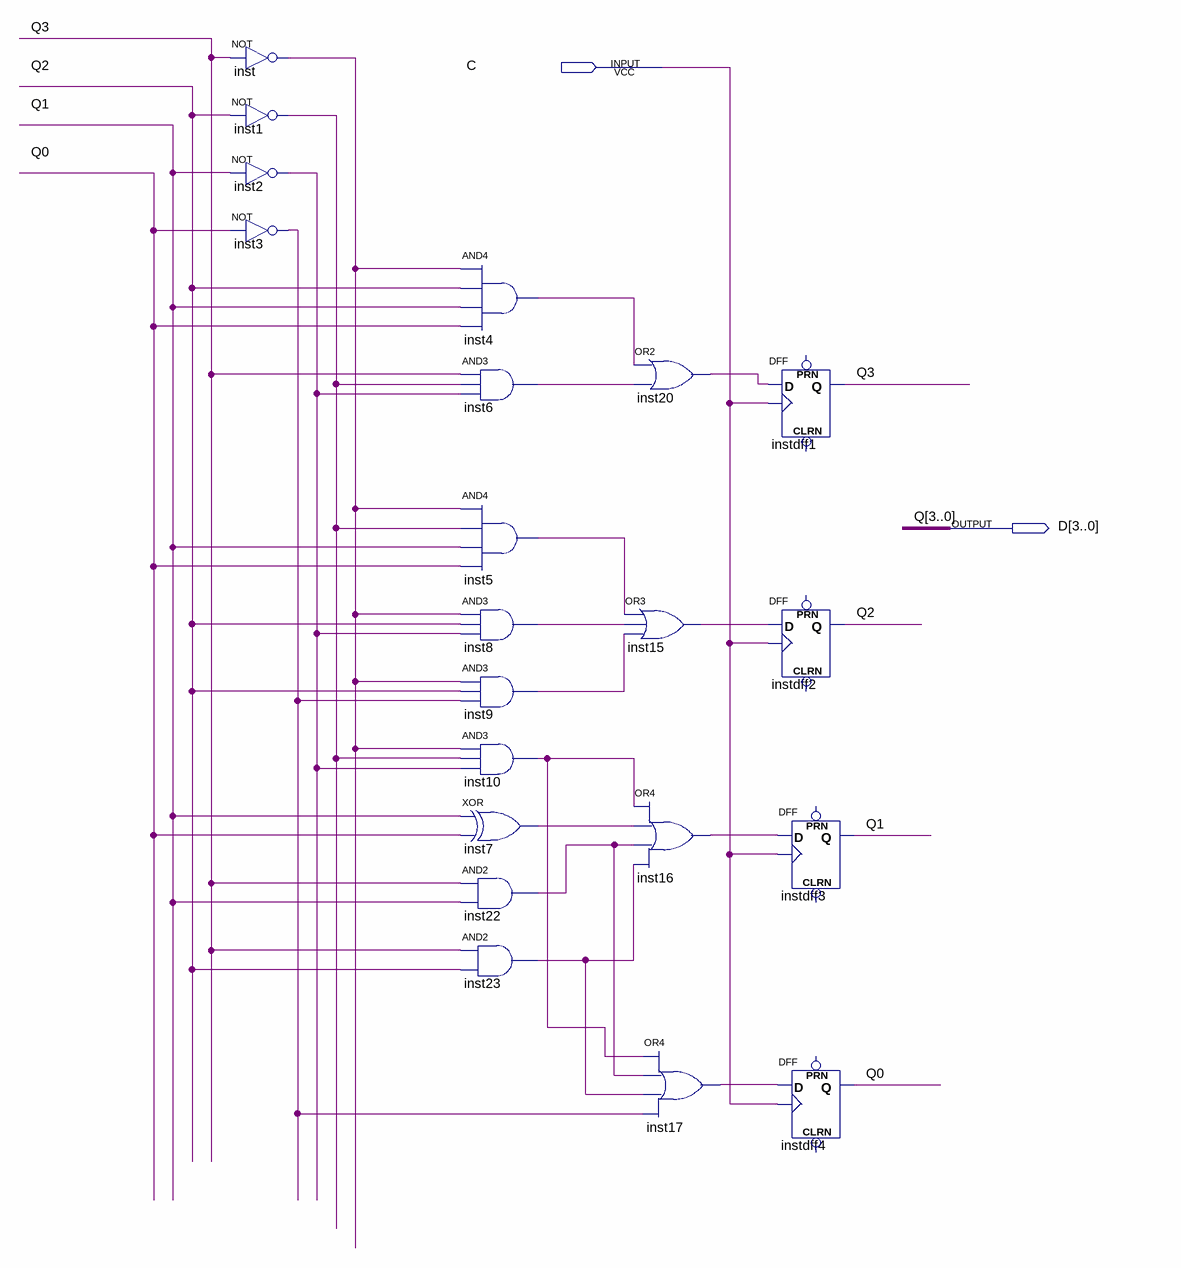
[diagram p0: schematic sheet]
// Quartus schematic 7_3.bdf as structural Verilog: 21 symbols, 2 pins
module \7_3  (
  input  C,
  output [3:0] D
);

  wire inst1_out, inst2_out, inst3_out, inst4_out, inst5_out, inst6_out, inst7_out, inst8_out, inst9_out,
       inst10_out, inst15_out, inst16_out, inst17_out, inst20_out, inst22_out, inst23_out, inst_out;

  not inst (inst_out, D[3]);
  not inst1 (inst1_out, D[2]);
  not inst2 (inst2_out, D[1]);
  not inst3 (inst3_out, D[0]);
  and inst4 (inst4_out, inst_out, D[2], D[1], D[0]);
  and inst6 (inst6_out, D[3], inst1_out, inst2_out);
  and inst5 (inst5_out, inst_out, inst1_out, D[1], D[0]);
  and inst8 (inst8_out, inst_out, D[2], inst2_out);
  and inst9 (inst9_out, inst_out, D[2], inst3_out);
  and inst10 (inst10_out, inst_out, inst1_out, inst2_out);
  xor inst7 (inst7_out, D[1], D[0]);
  and inst22 (inst22_out, D[3], D[1]);
  and inst23 (inst23_out, D[3], D[2]);
  or inst20 (inst20_out, inst4_out, inst6_out);
  or inst15 (inst15_out, inst5_out, inst8_out, inst9_out);
  or inst16 (inst16_out, inst10_out, inst7_out, inst22_out, inst23_out);
  or inst17 (inst17_out, inst10_out, inst22_out, inst23_out, inst3_out);
  DFF instdff1 (.CLK(C), .D(inst20_out), .Q(D[3]));  // open: CLRN, PRN
  DFF instdff2 (.CLK(C), .D(inst15_out), .Q(D[2]));  // open: CLRN, PRN
  DFF instdff3 (.CLK(C), .D(inst16_out), .Q(D[1]));  // open: CLRN, PRN
  DFF instdff4 (.CLK(C), .D(inst17_out), .Q(D[0]));  // open: CLRN, PRN

  // Other names for the same wires on the sheet: Q[3:0] = D; Q0 = D[0]; Q1 = D[1]; Q2 = D[2]; Q3 = D[3]
endmodule
